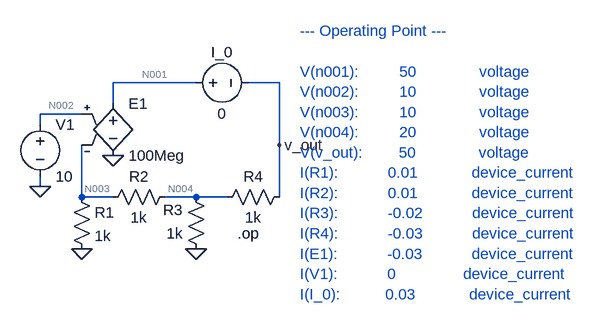
[diagram p0: schematic Q4.asc]
Q4.asc, the LTspice schematic file:
Version 4
SHEET 1 1040 680
WIRE 416 64 288 64
WIRE 544 64 496 64
WIRE 288 96 288 64
WIRE 240 112 176 112
WIRE 176 128 176 112
WIRE 544 160 544 64
WIRE 176 224 176 208
WIRE 240 240 240 160
WIRE 288 240 240 240
WIRE 416 240 368 240
WIRE 464 240 416 240
WIRE 544 240 544 160
FLAG 176 224 0
FLAG 416 320 0
FLAG 240 320 0
FLAG 288 176 0
FLAG 544 160 v_out
SYMBOL e 288 80 R0
SYMATTR InstName E1
SYMATTR Value 100Meg
SYMBOL voltage 176 112 R0
SYMATTR InstName V1
SYMATTR Value 10
SYMBOL res 224 224 R0
SYMATTR InstName R1
SYMATTR Value 1k
SYMBOL res 384 224 R90
WINDOW 0 0 56 VBottom 2
WINDOW 3 32 56 VTop 2
SYMATTR InstName R2
SYMATTR Value 1k
SYMBOL res 432 336 R180
WINDOW 0 36 76 Left 2
WINDOW 3 36 40 Left 2
SYMATTR InstName R3
SYMATTR Value 1k
SYMBOL res 448 256 R270
WINDOW 0 32 56 VTop 2
WINDOW 3 0 56 VBottom 2
SYMATTR InstName R4
SYMATTR Value 1k
SYMBOL voltage 400 64 R270
WINDOW 0 32 56 VTop 2
WINDOW 3 -32 56 VBottom 2
SYMATTR InstName I_0
SYMATTR Value 0
TEXT 480 296 Left 2 !.op
TEXT 576 -16 Left 2 ;--- Operating Point ---\n \nV(n001):         50              voltage\nV(n002):         10              voltage\nV(n003):         10              voltage\nV(n004):         20              voltage\nV(v_out):        50              voltage\nI(R1):           0.01            device_current\nI(R2):           0.01            device_current\nI(R3):           -0.02           device_current\nI(R4):           -0.03           device_current\nI(E1):           -0.03           device_current\nI(V1):           0               device_current\nI(I_0):          0.03            device_current

The netlist it stands for:
* Q4.asc
E1 N001 0 N002 N003 100Meg
V1 N002 0 10
R1 N003 0 1k
R2 N004 N003 1k
R3 0 N004 1k
R4 N004 v_out 1k
V§I_0 N001 v_out 0
.op
* --- Operating Point ---
* V(n001):         50              voltage
* V(n002):         10              voltage
* V(n003):         10              voltage
* V(n004):         20              voltage
* V(v_out):        50              voltage
* I(R1):           0.01            device_current
* I(R2):           0.01            device_current
* I(R3):           -0.02           device_current
* I(R4):           -0.03           device_current
* I(E1):           -0.03           device_current
* I(V1):           0               device_current
* I(I_0):          0.03            device_current
.backanno
.end

* Results of the author's LTspice run, read from the files saved beside the schematic
* Operating Point:
*   V(n001) = 50 V
*   V(n002) = 10 V
*   V(n003) = 10 V
*   V(n004) = 20 V
*   V(v_out) = 50 V
*   I(R1) = 10 mA
*   I(R2) = 10 mA
*   I(R3) = -20 mA
*   I(R4) = -30 mA
*   I(E1) = -30 mA
*   I(V1) = 0 A
*   I(I_0) = 30 mA